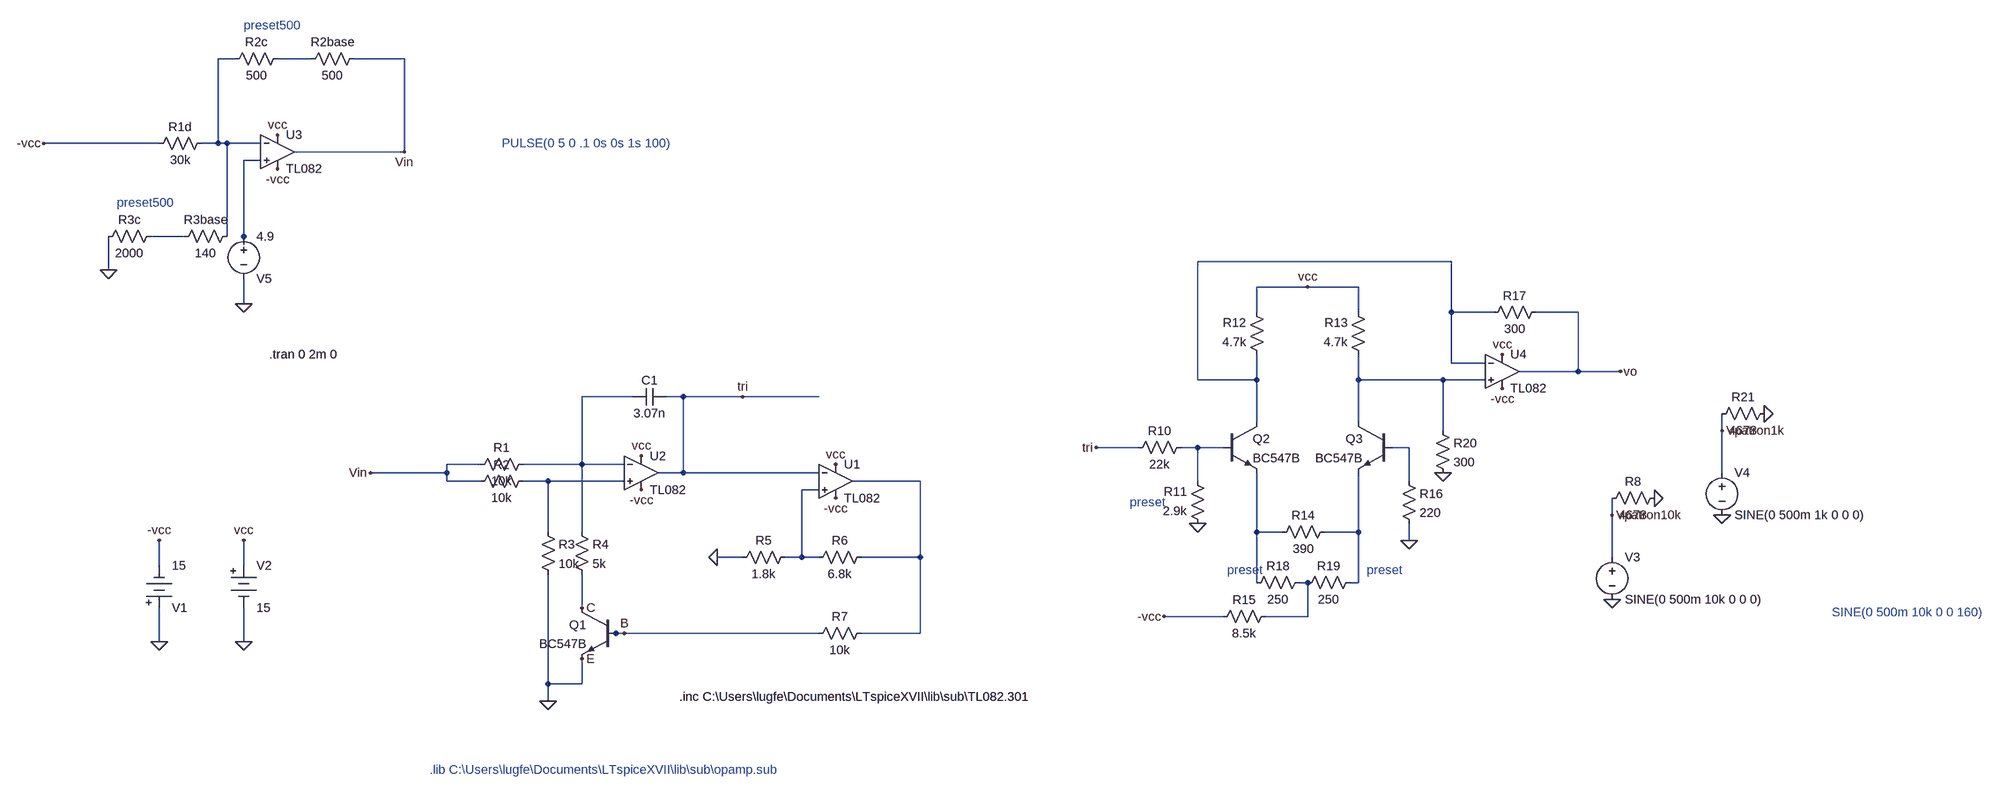
[diagram p0: schematic valen.asc]
valen.asc, the LTspice schematic file:
Version 4
SHEET 1 2788 924
WIRE -656 -656 -688 -656
WIRE -512 -656 -576 -656
WIRE -336 -656 -432 -656
WIRE -800 -496 -1024 -496
WIRE -688 -496 -688 -656
WIRE -688 -496 -720 -496
WIRE -672 -496 -688 -496
WIRE -608 -496 -672 -496
WIRE -336 -480 -336 -656
WIRE -336 -480 -544 -480
WIRE -608 -464 -640 -464
WIRE -752 -320 -816 -320
WIRE -672 -320 -672 -496
WIRE -640 -320 -640 -464
WIRE -640 -304 -640 -320
WIRE 1760 -272 1280 -272
WIRE -896 -256 -896 -320
WIRE 1488 -224 1392 -224
WIRE 1584 -224 1488 -224
WIRE -640 -192 -640 -240
WIRE 1392 -176 1392 -224
WIRE 1584 -176 1584 -224
WIRE 1760 -176 1760 -272
WIRE 1840 -176 1760 -176
WIRE 2000 -176 1920 -176
WIRE 1760 -80 1760 -176
WIRE 1824 -80 1760 -80
WIRE 2000 -64 2000 -176
WIRE 2000 -64 1888 -64
WIRE 2080 -64 2000 -64
WIRE 1280 -48 1280 -272
WIRE 1392 -48 1392 -96
WIRE 1392 -48 1280 -48
WIRE 1584 -48 1584 -96
WIRE 1744 -48 1584 -48
WIRE 1824 -48 1744 -48
WIRE 96 -16 0 -16
WIRE 192 -16 160 -16
WIRE 304 -16 192 -16
WIRE 448 -16 304 -16
WIRE 1392 32 1392 -48
WIRE 1584 32 1584 -48
WIRE 1744 48 1744 -48
WIRE 2272 48 2272 16
WIRE 1168 80 1088 80
WIRE 1280 80 1248 80
WIRE 1328 80 1280 80
WIRE 1680 80 1648 80
WIRE -192 112 -256 112
WIRE 0 112 0 -16
WIRE 0 112 -112 112
WIRE 80 112 0 112
WIRE -256 128 -256 112
WIRE -256 128 -400 128
WIRE 192 128 192 -16
WIRE 192 128 144 128
WIRE 448 128 192 128
WIRE 2272 128 2272 48
WIRE -256 144 -256 128
WIRE -192 144 -256 144
WIRE -64 144 -112 144
WIRE 80 144 -64 144
WIRE 640 144 512 144
WIRE 1280 144 1280 80
WIRE 1680 144 1680 80
WIRE 448 160 416 160
WIRE 2064 208 2064 176
WIRE -64 240 -64 144
WIRE 0 240 0 112
WIRE 1392 240 1392 128
WIRE 1440 240 1392 240
WIRE 1584 240 1584 128
WIRE 1584 240 1520 240
WIRE 1680 256 1680 224
WIRE 304 288 256 288
WIRE 416 288 416 160
WIRE 416 288 384 288
WIRE 448 288 416 288
WIRE 640 288 640 144
WIRE 640 288 528 288
WIRE 2064 288 2064 208
WIRE -800 304 -800 256
WIRE -640 304 -640 256
WIRE 1392 336 1392 240
WIRE 1488 336 1472 336
WIRE 1584 336 1584 240
WIRE 1584 336 1568 336
WIRE 0 384 0 320
WIRE 1328 400 1216 400
WIRE 1488 400 1488 336
WIRE 1488 400 1408 400
WIRE 64 432 48 432
WIRE 80 432 64 432
WIRE 448 432 80 432
WIRE 640 432 640 288
WIRE 640 432 528 432
WIRE -800 448 -800 384
WIRE -640 448 -640 384
WIRE -64 528 -64 320
WIRE 0 528 0 480
WIRE 0 528 -64 528
WIRE -64 560 -64 528
FLAG -64 560 0
FLAG 0 384 C
FLAG 0 480 E
FLAG 80 432 B
FLAG -640 256 vcc
FLAG -640 -192 0
FLAG -640 448 0
FLAG -800 256 -vcc
FLAG -800 448 0
FLAG 256 288 0
FLAG 1856 -32 -vcc
FLAG 1856 -96 vcc
FLAG 1088 80 tri
FLAG 1280 224 0
FLAG 1488 -224 vcc
FLAG 1744 128 0
FLAG 1680 256 0
FLAG 2080 -64 vo
FLAG 1216 400 -vcc
FLAG 2272 208 0
FLAG 2272 48 Vpatron1k
FLAG 2352 16 0
FLAG 2064 368 0
FLAG 2064 208 Vpatron10k
FLAG 2144 176 0
FLAG 112 96 vcc
FLAG 480 112 vcc
FLAG 112 160 -vcc
FLAG 480 176 -vcc
FLAG 304 -16 tri
FLAG -336 -480 Vin
FLAG -400 128 Vin
FLAG -576 -512 vcc
FLAG -576 -448 -vcc
FLAG -1024 -496 -vcc
FLAG -896 -256 0
SYMBOL res -96 96 R90
WINDOW 0 0 56 VBottom 2
WINDOW 3 32 56 VTop 2
SYMATTR InstName R1
SYMATTR Value 10k
SYMBOL res -96 128 R90
WINDOW 0 0 56 VBottom 2
WINDOW 3 32 56 VTop 2
SYMATTR InstName R2
SYMATTR Value 10k
SYMBOL res -80 224 R0
SYMATTR InstName R3
SYMATTR Value 10k
SYMBOL res -16 224 R0
SYMATTR InstName R4
SYMATTR Value 5k
SYMBOL res 400 272 R90
WINDOW 0 0 56 VBottom 2
WINDOW 3 32 56 VTop 2
SYMATTR InstName R5
SYMATTR Value 1.8k
SYMBOL res 544 272 R90
WINDOW 0 0 56 VBottom 2
WINDOW 3 32 56 VTop 2
SYMATTR InstName R6
SYMATTR Value 6.8k
SYMBOL res 432 448 R270
WINDOW 0 32 56 VTop 2
WINDOW 3 0 56 VBottom 2
SYMATTR InstName R7
SYMATTR Value 10k
SYMBOL cap 160 -32 R90
WINDOW 0 0 32 VBottom 2
WINDOW 3 32 32 VTop 2
SYMATTR InstName C1
SYMATTR Value 3.07n
SYMBOL Misc\\battery -640 288 R0
WINDOW 123 0 0 Left 0
WINDOW 39 0 0 Left 0
SYMATTR InstName V2
SYMATTR Value 15
SYMBOL npn 64 384 M0
SYMATTR InstName Q1
SYMATTR Value BC547B
SYMBOL Misc\\battery -800 400 M180
WINDOW 123 0 0 Left 0
WINDOW 39 0 0 Left 0
SYMATTR InstName V1
SYMATTR Value 15
SYMBOL res 1264 64 R90
WINDOW 0 0 56 VBottom 2
WINDOW 3 32 56 VTop 2
SYMATTR InstName R10
SYMATTR Value 22k
SYMBOL res 1296 240 R180
WINDOW 0 36 76 Left 2
WINDOW 3 36 40 Left 2
SYMATTR InstName R11
SYMATTR Value 2.9k
SYMBOL npn 1328 32 R0
SYMATTR InstName Q2
SYMATTR Value BC547B
SYMBOL npn 1648 32 M0
SYMATTR InstName Q3
SYMATTR Value BC547B
SYMBOL res 1408 -80 R180
WINDOW 0 36 76 Left 2
WINDOW 3 36 40 Left 2
SYMATTR InstName R12
SYMATTR Value 4.7k
SYMATTR SpiceLine tol=1 pwr=0.1
SYMBOL res 1600 -80 R180
WINDOW 0 36 76 Left 2
WINDOW 3 36 40 Left 2
SYMATTR InstName R13
SYMATTR Value 4.7k
SYMBOL res 1536 224 R90
WINDOW 0 0 56 VBottom 2
WINDOW 3 32 56 VTop 2
SYMATTR InstName R14
SYMATTR Value 390
SYMBOL Opamps\\opamp2 1856 -128 R0
SYMATTR InstName U4
SYMATTR Value TL082
SYMBOL res 1728 32 R0
SYMATTR InstName R20
SYMATTR Value 300
SYMBOL res 1664 128 R0
SYMATTR InstName R16
SYMATTR Value 220
SYMBOL res 1424 384 R90
WINDOW 0 0 56 VBottom 2
WINDOW 3 32 56 VTop 2
SYMATTR InstName R15
SYMATTR Value 8.5k
SYMBOL res 1936 -192 R90
WINDOW 0 0 56 VBottom 2
WINDOW 3 32 56 VTop 2
SYMATTR InstName R17
SYMATTR Value 300
SYMBOL voltage 2272 112 R0
WINDOW 123 0 0 Left 0
WINDOW 39 0 0 Left 0
SYMATTR InstName V4
SYMATTR Value SINE(0 500m 1k 0 0 0)
SYMBOL res 2368 0 R90
WINDOW 0 0 56 VBottom 2
WINDOW 3 32 56 VTop 2
SYMATTR InstName R21
SYMATTR Value 4678
SYMBOL res 1488 320 R90
WINDOW 0 0 56 VBottom 2
WINDOW 3 32 56 VTop 2
SYMATTR InstName R18
SYMATTR Value 250
SYMBOL res 1472 352 R270
WINDOW 0 32 56 VTop 2
WINDOW 3 0 56 VBottom 2
SYMATTR InstName R19
SYMATTR Value 250
SYMBOL voltage -640 -336 R0
WINDOW 0 24 96 Left 2
WINDOW 3 24 16 Left 2
WINDOW 123 0 0 Left 0
WINDOW 39 0 0 Left 0
SYMATTR InstName V5
SYMATTR Value 4.9
SYMBOL voltage 2064 272 R0
WINDOW 123 0 0 Left 0
WINDOW 39 0 0 Left 0
SYMATTR InstName V3
SYMATTR Value SINE(0 500m 10k 0 0 0)
SYMBOL res 2160 160 R90
WINDOW 0 0 56 VBottom 2
WINDOW 3 32 56 VTop 2
SYMATTR InstName R8
SYMATTR Value 4678
SYMBOL Opamps\\opamp2 480 80 R0
SYMATTR InstName U1
SYMATTR Value TL082
SYMBOL Opamps\\opamp2 112 64 R0
SYMATTR InstName U2
SYMATTR Value TL082
SYMBOL Opamps\\opamp2 -576 -544 R0
SYMATTR InstName U3
SYMATTR Value TL082
SYMBOL res -704 -512 R90
WINDOW 0 0 56 VBottom 2
WINDOW 3 32 56 VTop 2
SYMATTR InstName R1d
SYMATTR Value 30k
SYMBOL res -560 -672 R90
WINDOW 0 0 56 VBottom 2
WINDOW 3 32 56 VTop 2
SYMATTR InstName R2c
SYMATTR Value 500
SYMBOL res -416 -672 R90
WINDOW 0 0 56 VBottom 2
WINDOW 3 32 56 VTop 2
SYMATTR InstName R2base
SYMATTR Value 500
SYMBOL res -800 -336 R90
WINDOW 0 0 56 VBottom 2
WINDOW 3 32 56 VTop 2
SYMATTR InstName R3c
SYMATTR Value 2000
SYMBOL res -656 -336 R90
WINDOW 0 0 56 VBottom 2
WINDOW 3 32 56 VTop 2
SYMATTR InstName R3base
SYMATTR Value 140
TEXT 184 552 Left 2 !.inc C:\\Users\\lugfe\\Documents\\LTspiceXVII\\lib\\sub\\TL082.301
TEXT 2480 392 Left 2 ;SINE(0 500m 10k 0 0 160)
TEXT 1152 184 Left 2 ;preset
TEXT 1336 312 Left 2 ;preset
TEXT 1600 312 Left 2 ;preset
TEXT -288 824 Left 2 ;.lib C:\\Users\\lugfe\\Documents\\LTspiceXVII\\lib\\sub\\opamp.sub
TEXT -640 -720 Left 2 ;preset500
TEXT -880 -384 Left 2 ;preset500
TEXT -592 -96 Left 2 !.tran 0 2m 0
TEXT -152 -496 Left 2 ;PULSE(0 5 0 .1 0s 0s 1s 100)

The netlist it stands for:
* valen.asc
R1 N007 Vin 10k
R2 N010 Vin 10k
R3 N010 0 10k
R4 N007 C 5k
R5 N012 0 1.8k
R6 N011 N012 6.8k
R7 B N011 10k
C1 tri N007 3.07n
V2 vcc 0 15
Q1 C B 0 0 BC547B
V1 0 -vcc 15
R10 N008 tri 22k
R11 0 N008 2.9k
Q2 N005 N008 N013 0 BC547B
Q3 N006 N009 N014 0 BC547B
R12 N005 vcc 4.7k tol=1 pwr=0.1
R13 N006 vcc 4.7k
R14 N014 N013 390
XU4 N006 N005 vcc -vcc vo TL082  ; pins In+ In- V+ V- OUT
R20 N006 0 300
R16 N009 0 220
R15 N015 -vcc 8.5k
R17 vo N005 300
V4 Vpatron1k 0 SINE(0 500m 1k 0 0 0)
R21 0 Vpatron1k 4678
R18 N015 N013 250
R19 N015 N014 250
V5 N003 0 4.9
V3 Vpatron10k 0 SINE(0 500m 10k 0 0 0)
R8 0 Vpatron10k 4678
XU1 N012 tri vcc -vcc N011 TL082  ; pins In+ In- V+ V- OUT
XU2 N010 N007 vcc -vcc tri TL082  ; pins In+ In- V+ V- OUT
XU3 N003 N001 vcc -vcc Vin TL082  ; pins In+ In- V+ V- OUT
R1d N001 -vcc 30k
R2c N002 N001 500
R2base Vin N002 500
R3c N004 0 2000
R3base N001 N004 140
.model NPN NPN
.model PNP PNP
.lib standard.bjt
.inc C:\Users\lugfe\Documents\LTspiceXVII\lib\sub\TL082.301
* SINE(0 500m 10k 0 0 160)
* preset
* preset
* preset
* .lib C:\Users\lugfe\Documents\LTspiceXVII\lib\sub\opamp.sub
* preset500
* preset500
.tran 0 2m 0
* PULSE(0 5 0 .1 0s 0s 1s 100)
.backanno
.end